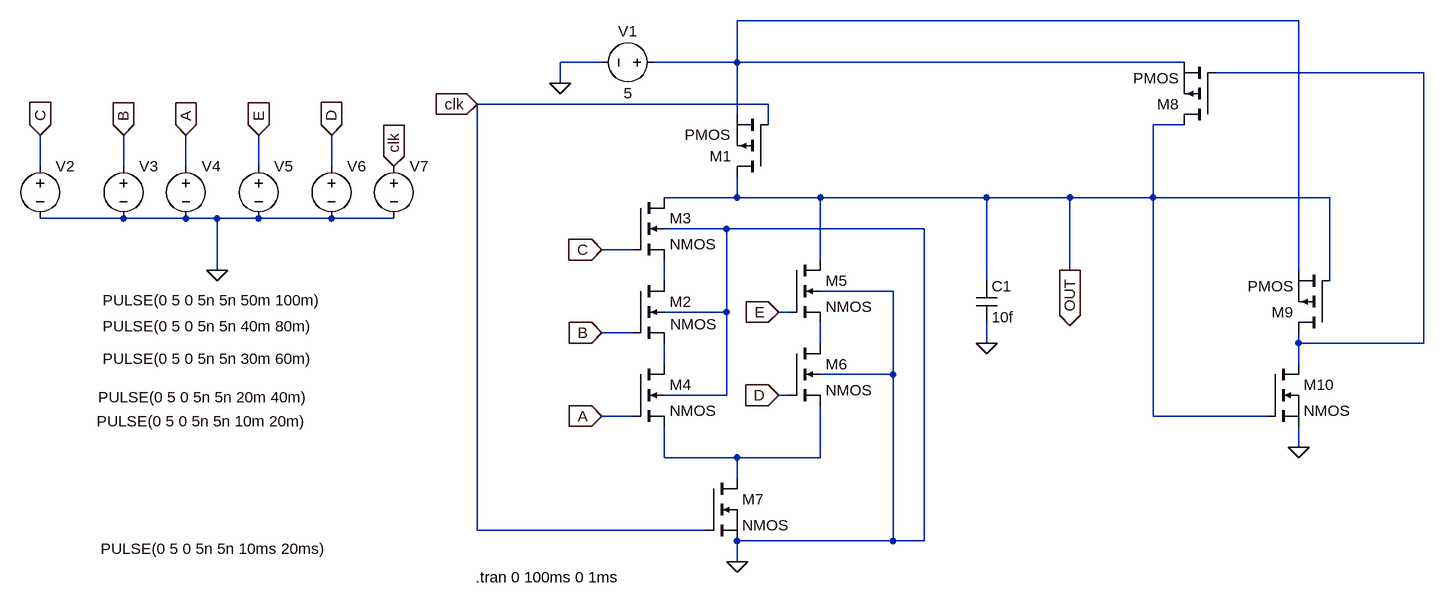
[diagram p0: schematic DOMINO AOI32 CIRCUIT.asc]
DOMINO AOI32 CIRCUIT.asc, the LTspice schematic file:
Version 4
SHEET 1 1420 744
WIRE 992 -128 128 -128
WIRE -80 -64 -144 -64
WIRE 128 -64 128 -128
WIRE 128 -64 0 -64
WIRE 816 -64 128 -64
WIRE 1184 -48 864 -48
WIRE -144 -32 -144 -64
WIRE 176 0 -272 0
WIRE 128 16 128 -64
WIRE 176 32 176 0
WIRE 816 32 768 32
WIRE -944 96 -944 48
WIRE -816 96 -816 48
WIRE -720 96 -720 48
WIRE -608 96 -608 48
WIRE -496 96 -496 48
WIRE 128 144 128 112
WIRE 128 144 16 144
WIRE 256 144 128 144
WIRE 512 144 256 144
WIRE 640 144 512 144
WIRE 768 144 768 32
WIRE 768 144 640 144
WIRE 1040 144 768 144
WIRE -816 176 -944 176
WIRE -720 176 -816 176
WIRE -672 176 -720 176
WIRE -608 176 -672 176
WIRE -496 176 -608 176
WIRE -400 176 -496 176
WIRE 112 192 16 192
WIRE 416 192 112 192
WIRE -32 224 -80 224
WIRE 256 240 256 144
WIRE -672 256 -672 176
WIRE 640 256 640 144
WIRE 992 256 992 -128
WIRE 16 272 16 240
WIRE 512 272 512 144
WIRE 1040 272 1040 144
WIRE 368 288 256 288
WIRE 112 320 112 192
WIRE 112 320 16 320
WIRE 208 320 192 320
WIRE -32 352 -80 352
WIRE 256 368 256 336
WIRE 512 368 512 336
WIRE 992 368 992 352
WIRE 1184 368 1184 -48
WIRE 1184 368 992 368
WIRE 16 400 16 368
WIRE 992 400 992 368
WIRE 368 416 368 288
WIRE 368 416 256 416
WIRE 112 448 112 320
WIRE 112 448 16 448
WIRE 208 448 192 448
WIRE -32 480 -80 480
WIRE 768 480 768 144
WIRE 944 480 768 480
WIRE 992 528 992 496
WIRE 16 544 16 496
WIRE 128 544 16 544
WIRE 256 544 256 464
WIRE 256 544 128 544
WIRE 128 576 128 544
WIRE -272 656 -272 0
WIRE 80 656 -272 656
WIRE 368 672 368 416
WIRE 368 672 128 672
WIRE 416 672 416 192
WIRE 416 672 368 672
WIRE 128 704 128 672
FLAG 128 704 0
FLAG -144 -32 0
FLAG 512 368 0
FLAG 992 528 0
FLAG -80 224 C
IOPIN -80 224 In
FLAG -80 352 B
IOPIN -80 352 In
FLAG -80 480 A
IOPIN -80 480 In
FLAG 192 320 E
IOPIN 192 320 In
FLAG 192 448 D
IOPIN 192 448 In
FLAG 640 256 OUT
IOPIN 640 256 Out
FLAG -672 256 0
FLAG -944 48 C
IOPIN -944 48 In
FLAG -816 48 B
IOPIN -816 48 In
FLAG -720 48 A
IOPIN -720 48 In
FLAG -608 48 E
IOPIN -608 48 In
FLAG -496 48 D
IOPIN -496 48 In
FLAG -400 96 clk
IOPIN -400 96 In
FLAG -272 0 clk
IOPIN -272 0 In
SYMBOL pmos 176 112 R180
WINDOW 3 58 65 Left 2
SYMATTR InstName M1
SYMBOL cap 496 272 R0
SYMATTR InstName C1
SYMATTR Value 10f
SYMBOL nmos4 -32 272 R0
WINDOW 3 57 67 Left 2
SYMATTR InstName M2
SYMBOL nmos4 -32 144 R0
SYMATTR InstName M3
SYMBOL nmos4 208 240 R0
SYMATTR InstName M5
SYMBOL nmos 80 576 R0
SYMATTR InstName M7
SYMBOL nmos4 -32 400 R0
SYMATTR InstName M4
SYMBOL voltage 16 -64 R90
WINDOW 0 -32 56 VBottom 2
WINDOW 3 32 56 VTop 2
WINDOW 123 0 0 Left 0
WINDOW 39 0 0 Left 0
SYMATTR InstName V1
SYMATTR Value 5
SYMBOL nmos4 208 368 R0
SYMATTR InstName M6
SYMBOL pmos 864 32 R180
SYMATTR InstName M8
SYMBOL pmos 1040 352 R180
SYMATTR InstName M9
SYMBOL nmos 944 400 R0
SYMATTR InstName M10
SYMBOL voltage -944 80 R0
WINDOW 3 96 222 Left 2
WINDOW 123 0 0 Left 0
WINDOW 39 0 0 Left 0
SYMATTR InstName V2
SYMATTR Value PULSE(0 5 0 5n 5n 50m 100m)
SYMBOL voltage -816 80 R0
WINDOW 3 -32 262 Left 2
WINDOW 123 0 0 Left 0
WINDOW 39 0 0 Left 0
SYMATTR InstName V3
SYMATTR Value PULSE(0 5 0 5n 5n 40m 80m)
SYMBOL voltage -720 80 R0
WINDOW 3 -128 312 Left 2
WINDOW 123 0 0 Left 0
WINDOW 39 0 0 Left 0
SYMATTR InstName V4
SYMATTR Value PULSE(0 5 0 5n 5n 30m 60m)
SYMBOL voltage -608 80 R0
WINDOW 3 -247 371 Left 2
WINDOW 123 0 0 Left 0
WINDOW 39 0 0 Left 0
SYMATTR InstName V5
SYMATTR Value PULSE(0 5 0 5n 5n 20m 40m)
SYMBOL voltage -496 80 R0
WINDOW 3 -361 408 Left 2
WINDOW 123 0 0 Left 0
WINDOW 39 0 0 Left 0
SYMATTR InstName V6
SYMATTR Value PULSE(0 5 0 5n 5n 10m 20m)
SYMBOL voltage -400 80 R0
WINDOW 3 -451 604 Left 2
WINDOW 123 0 0 Left 0
WINDOW 39 0 0 Left 0
SYMATTR InstName V7
SYMATTR Value PULSE(0 5 0 5n 5n 10ms 20ms)
TEXT -274 728 Left 2 !.tran 0 100ms 0 1ms

The netlist it stands for:
* DOMINO AOI32 CIRCUIT.asc
M1 OUT clk N001 N001 PMOS
C1 OUT 0 10f
M2 N003 B N005 0 NMOS
M3 OUT C N003 0 NMOS
M5 OUT E N004 0 NMOS
M7 N006 clk 0 0 NMOS
M4 N005 A N006 0 NMOS
V1 N001 0 5
M6 N004 D N006 0 NMOS
M8 OUT N002 N001 N001 PMOS
M9 N002 OUT N001 N001 PMOS
M10 N002 OUT 0 0 NMOS
V2 C 0 PULSE(0 5 0 5n 5n 50m 100m)
V3 B 0 PULSE(0 5 0 5n 5n 40m 80m)
V4 A 0 PULSE(0 5 0 5n 5n 30m 60m)
V5 E 0 PULSE(0 5 0 5n 5n 20m 40m)
V6 D 0 PULSE(0 5 0 5n 5n 10m 20m)
V7 clk 0 PULSE(0 5 0 5n 5n 10ms 20ms)
.model NMOS NMOS
.model PMOS PMOS
.lib standard.mos
.tran 0 100ms 0 1ms
.backanno
.end